# Altium schematic sheet Connectors+CSA.SchDoc
size A4; SheetNumber: 2; SheetTotal: 2
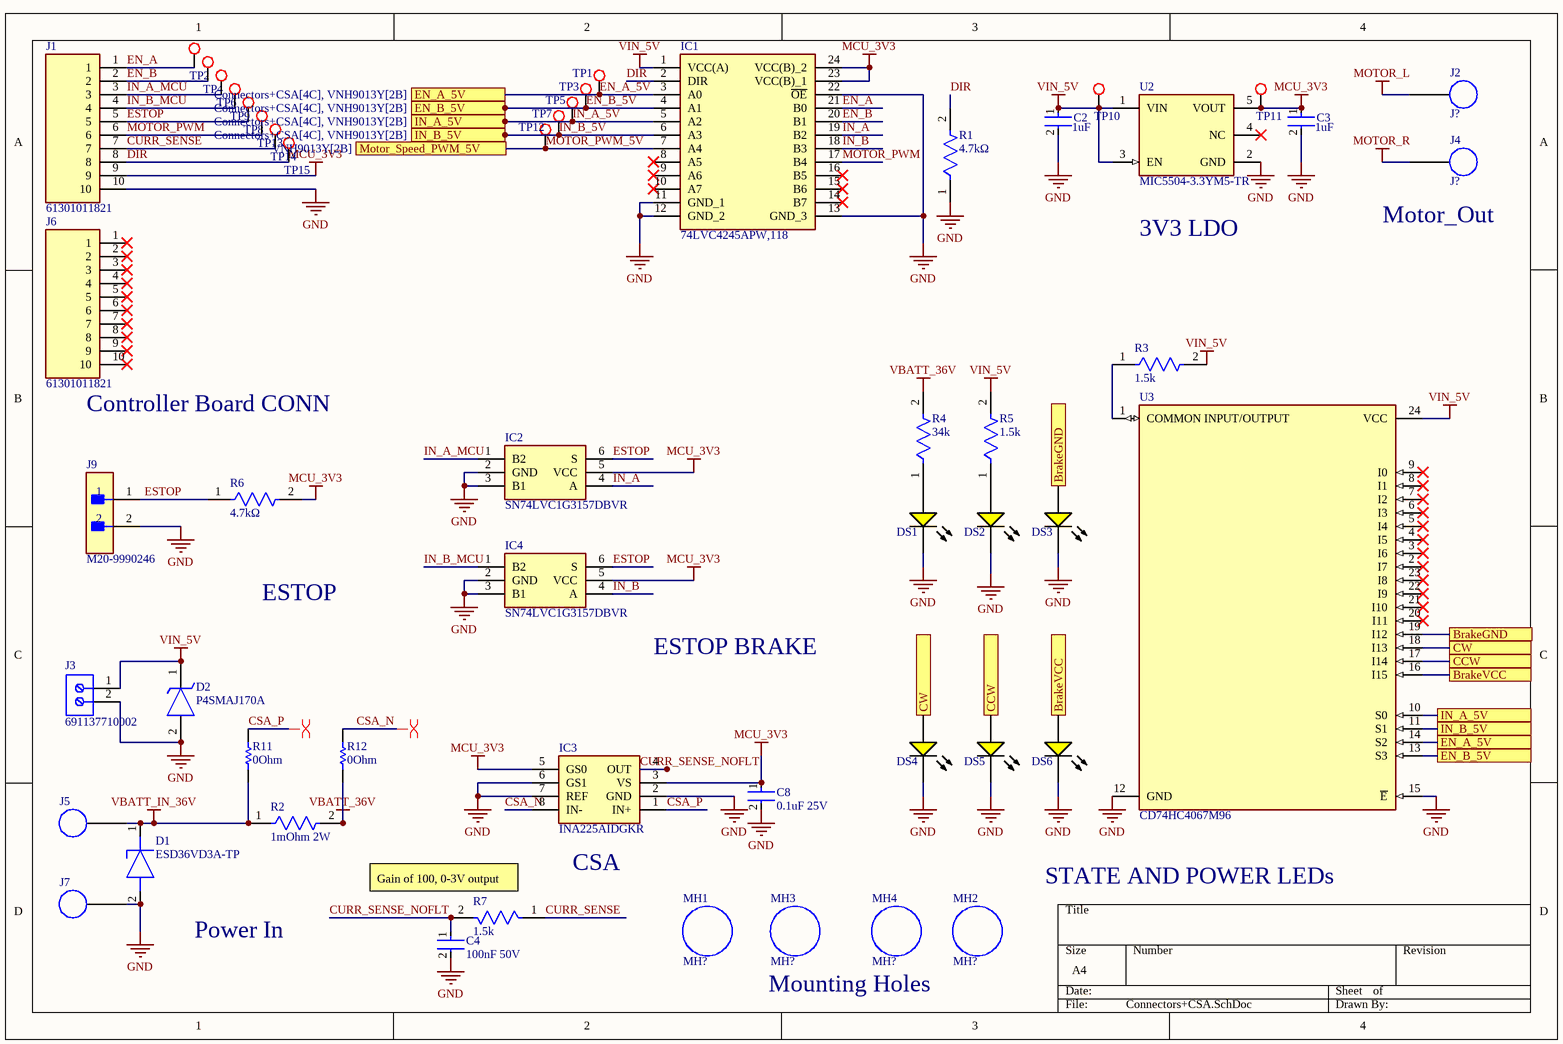
[diagram p0: Connectors+CSA.SchDoc]

## Parts
C2  1uF  [FP-CL10-IPC_C]
C3  1uF  [FP-CL10-IPC_C]
C4  100nF 50V  [FP-CL31-IPC_C]
C8  0.1uF 25V  [FP-CL21-IPC_C]
D1  ESD36VD3A-TP  [SOD2512X115N]
D2  P4SMAJ170A  [DIOM5027X240N]
DS1  HSMY-C190  [AVAG-HSMX-C190_V]  (value not drawn)
DS2  HSMY-C190  [AVAG-HSMX-C190_V]  (value not drawn)
DS3  HSMY-C190  [AVAG-HSMX-C190_V]  (value not drawn)
DS4  HSMY-C190  [AVAG-HSMX-C190_V]  (value not drawn)
DS5  HSMY-C190  [AVAG-HSMX-C190_V]  (value not drawn)
DS6  HSMY-C190  [AVAG-HSMX-C190_V]  (value not drawn)
IC1  74LVC4245APW,118  [SOP65P640X110-24N]
IC2  SN74LVC1G3157DBVR  [SOT95P280X145-6N]
IC3  INA225AIDGKR  [SOP65P490X110-8N]
IC4  SN74LVC1G3157DBVR  [SOT95P280X145-6N]
J1  61301011821  [RHDR10W60P0X254_1X10_2590X250X850P]
J2  J?  [Power Screw Terminal]  (no BOM)
J3  691137710002  [691137710002]
J4  J?  [Power Screw Terminal]  (no BOM)
J5  J?  [Power Screw Terminal]  (value not drawn)  (no BOM)
J6  61301011821  [RHDR10W60P0X254_1X10_2590X250X850P]
J7  J?  [Power Screw Terminal]  (value not drawn)  (no BOM)
J9  M20-9990246  [FP-M20-9990246-MFG]  (no BOM)
MH1  MH?  [Mounting Hole]  (no BOM)
MH2  MH?  [Mounting Hole]  (no BOM)
MH3  MH?  [Mounting Hole]  (no BOM)
MH4  MH?  [Mounting Hole]  (no BOM)
R1  4.7kΩ  [FP-RT0805-MFG]
R2  1mOhm 2W  [FP-WSL2512-MFG]
R3  1.5k  [FP-RC1608-IPC_B]
R4  34k  [FP-CRCW0805-e3-IPC_B]
R5  1.5k  [FP-RC1608-IPC_B]
R6  4.7kΩ  [FP-RT0805-MFG]
R7  1.5k  [FP-CRCW0603-e3-IPC_A]
R11  0Ohm  [RESC2013X60X35LL10T20]  (no BOM)
R12  0Ohm  [RESC2013X60X35LL10T20]  (no BOM)
TP1  TP  [Testpoint]  (value not drawn)  (no BOM)
TP2  TP  [Testpoint]  (value not drawn)
TP3  TP  [Testpoint]  (value not drawn)  (no BOM)
TP4  TP  [Testpoint]  (value not drawn)
TP5  TP  [Testpoint]  (value not drawn)  (no BOM)
TP6  TP  [Testpoint]  (value not drawn)
TP7  TP  [Testpoint]  (value not drawn)  (no BOM)
TP8  TP  [Testpoint]  (value not drawn)  (no BOM)
TP9  TP  [Testpoint]  (value not drawn)
TP10  TP  [Testpoint]  (value not drawn)  (no BOM)
TP11  TP  [Testpoint]  (value not drawn)  (no BOM)
TP12  TP  [Testpoint]  (value not drawn)  (no BOM)
TP13  TP  [Testpoint]  (value not drawn)  (no BOM)
TP14  TP  [Testpoint]  (value not drawn)  (no BOM)
TP15  TP  [Testpoint]  (value not drawn)  (no BOM)
U2  MIC5504-3.3YM5-TR  [FP-SOT23-5LD-PL-1-MFG]
U3  CD74HC4067M96  [FP-DW0024A-MFG]

## Ports
BrakeGND (see Connectors+CSA[3B]), BrakeGND (see Connectors+CSA[4C]), BrakeVCC (see Connectors+CSA[3C]), BrakeVCC (see Connectors+CSA[4C]), CCW (see Connectors+CSA[3C]), CCW (see Connectors+CSA[4C]), CW (see Connectors+CSA[3C]), CW (see Connectors+CSA[4C]), EN_A_5V (see Connectors+CSA[2A], VNH9013Y[2B]), EN_A_5V (see Connectors+CSA[4C], VNH9013Y[2B]), EN_B_5V (see Connectors+CSA[2A], VNH9013Y[2B]), EN_B_5V (see Connectors+CSA[4C], VNH9013Y[2B]), IN_A_5V (see Connectors+CSA[2A], VNH9013Y[2B]), IN_A_5V (see Connectors+CSA[4C], VNH9013Y[2B]), IN_B_5V (see Connectors+CSA[2A], VNH9013Y[2B]), IN_B_5V (see Connectors+CSA[4C], VNH9013Y[2B]), Motor_Speed_PWM_5V (see VNH9013Y[2B])

## Nets
GND: C2.2 C3.2 C4.2 C8.2 D1.2(A) D2.2(A) DS1.2(K) DS2.2(K) DS3.2(K) DS4.2(K) DS5.2(K) DS6.2(K) IC1.11(GND_1) IC1.12(GND_2) IC1.13(GND_3) IC1.22(~{OE}) IC2.2(GND) IC2.3(B1) IC3.2(GND) IC3.6(GS1) IC3.7(REF) IC4.2(GND) IC4.3(B1) J1.10 J3.2 J7.1 J9.2 R1.1 U2.2(GND) U3.12(GND) U3.15(~{E})
MCU_3V3: C3.1 C8.1 IC1.23(VCC(B)_1) IC1.24(VCC(B)_2) IC2.5(VCC) IC3.3(VS) IC3.5(GS0) IC4.5(VCC) J1.9 R6.2 TP11.0 U2.5(VOUT)
MOTOR_L: J2.1
MOTOR_R: J4.1
VBATT_36V: R2.2 R4.2 R12.2
VBATT_IN_36V: D1.1(K) J5.1 R2.1 R11.2
VIN_5V: C2.1 D2.1(K) IC1.1(VCC(A)) J3.1 R3.2 R5.2 TP10.0 U2.1(VIN) U2.3(EN) U3.24(VCC)
BrakeGND: DS3.1(A) U3.19(I12) ; port BrakeGND
BrakeVCC: DS6.1(A) U3.16(I15) ; port BrakeVCC
CCW: DS5.1(A) U3.17(I14) ; port CCW
CSA_N: IC3.8(IN-) R12.1
CSA_P: IC3.1(IN+) R11.1
CURR_SENSE: J1.7 R7.1 TP14.0
CURR_SENSE_NOFLT: C4.1 IC3.4(OUT) R7.2
CW: DS4.1(A) U3.18(I13) ; port CW
DIR: IC1.2(DIR) J1.8 R1.2 TP15.0
EN_A: IC1.21(B0) J1.1 TP2.0
EN_A_5V: IC1.3(A0) TP1.0 U3.14(S2) ; port EN_A_5V
EN_B: IC1.20(B1) J1.2 TP4.0
EN_B_5V: IC1.4(A1) TP3.0 U3.13(S3) ; port EN_B_5V
ESTOP: IC2.6(S) IC4.6(S) J1.5 J9.1 R6.1 TP8.0
IN_A: IC1.19(B2) IC2.4(A)
IN_A_5V: IC1.5(A2) TP5.0 U3.10(S0) ; port IN_A_5V
IN_A_MCU: IC2.1(B2) J1.3 TP6.0
IN_B: IC1.18(B3) IC4.4(A)
IN_B_5V: IC1.6(A3) TP7.0 U3.11(S1) ; port IN_B_5V
IN_B_MCU: IC4.1(B2) J1.4 TP9.0
MOTOR_PWM: IC1.17(B4) J1.6 TP13.0
MOTOR_PWM_5V: IC1.7(A4) TP12.0 ; port Motor_Speed_PWM_5V
NetDS1_1: DS1.1(A) R4.1
NetDS2_1: DS2.1(A) R5.1
NetR3_1: R3.1 U3.1(COMMON_INPUT/OUTPUT)

Not connected (* = marked no-connect by the designer): IC1 8(A5)* 9(A6)* 10(A7)* 14(B7)* 15(B6)* 16(B5)*; J6 1* 2* 3* 4* 5* 6* 7* 8* 9* 10*; U2 4(NC)*; U3 2(I7)* 3(I6)* 4(I5)* 5(I4)* 6(I3)* 7(I2)* 8(I1)* 9(I0)* 20(I11)* 21(I10)* 22(I9)* 23(I8)*

## Layout directives
differential pair: CSA_N, CSA_P

## Notes on the sheet
- 3V3 LDO
- (near J4) Motor_Out
- (near J6) Controller Board CONN
- ESTOP
- (near IC4) ESTOP BRAKE
- (near R7) Gain of 100, 0-3V output
- (near IC3) CSA
- STATE AND POWER LEDs
- Power In
- Mounting Holes

## Library data of the parts
C2 C3 = CMP-13271-003399-1: Cap Ceramic 1uF 10V X5R ±10% Pad SMD 0603 +85°C T/R; Min Operating Temperature: -55°C; Max Operating Temperature: 85°C; Dielectric: X5R; Contact Plating: Tin; Height: 0.8mm; Voltage: 10V; Packaging: Tape and Reel; Voltage Rating: 10V; Capacitance: 1uF; Package Quantity: 1; Width: 0.031inch; Length: 1.6mm; Depth: 0.8mm; Case/Package: 0603; Case Code (Imperial): 0603; Thickness: 0.035inch; Radiation Hardening: No; Tolerance: 10%; Case Code (Metric): 1608; Mount: Surface Mount
C4 = CMP-13271-001276-1: Cap Ceramic 100nF 50V X7R ±10% SMD 1206 +125°C Embossed T/R; Dielectric: X7R; Case Code (Metric): 3216; Package Quantity: 1; Thickness: 0.037inch; Depth: 1.6mm; Packaging: Tape and Reel; Capacitance: 100nF; Length: 0.126inch; Tolerance: 10%; Voltage Rating: 50V; Case Code (Imperial): 1206; Radiation Hardening: No; Width: 0.063inch; Case/Package: 1206; Max Operating Temperature: 125°C; Min Operating Temperature: -55°C; Height: 0.85mm; Mount: Surface Mount
C8 = CMP-13271-002094-1: CL21 Series 0805 100nF 25V -20/+80% Tolerance Y5V Multilayer Ceramic Chip Capacitor; Tolerance: 80%; Case/Package: 0805; Width: 0.049inch; Mount: Surface Mount; Packaging: Tape and Reel; Dielectric: Y5V; Voltage Rating (DC): 25V; Thickness: 0.03inch; Lead Free: Lead Free; Package Quantity: 1; Max Operating Temperature: 85°C; Case Code (Imperial): 0805; Min Operating Temperature: -30°C; Length: 2mm; Height: 0.65mm; Radiation Hardening: No; Depth: 1.25mm; Capacitance: 100nF; Case Code (Metric): 2012; Voltage Rating: 25V
D1 = ESD36VD3A-TP: Diode ESD (Uni-directional); Manufacturer_Name: MCC; Datasheet Link: https://www.mccsemi.com/pdf/Products/ESD3V3D3A_ESD36VD3A(SOD-323).pdf; Height: 1.15mm; Manufacturer_Part_Number: ESD36VD3A-TP
D2 = P4SMAJ170A: TVS Diode (Uni-directional); Manufacturer_Name: Diotec; Datasheet Link: https://diotec.com/request/datasheet/p4smaj65.pdf; Height: 2.4mm; Manufacturer_Part_Number: P4SMAJ170A
DS1-DS6 = CMP-1744-00003-1: LED Uni-Color Yellow, 65 mW, 20 mA, -40 to 85 degC, 2-Pin SMD, RoHS, Tape and Reel; Tolerance: 1%; Voltage Rating: 50 V; Power Rating: 100 mW; Case\Package: 0603; Resistance: 390 Ohm; Min Operating Temperature: -55 degC; Length: 1.6 mm; ComponentLink3Description: Package Specification; Mount: Surface Mount; PackageReference: HSMX-C190; ComponentLink2Description: Datasheet; DatasheetVersion: Mar-12; Case Code (Metric): 1608; Pins: 2; Package Quantity: 5000; ComponentLink2URL: http://docs.avagotech.com/docs/AV02-0551EN; ComponentLink1Description: Manufacturer URL; RoHSCompliant: true; Packaging: Tape and Reel; PackageDescription: 2-Pin Surface Mount Device, Body 1.6 x 0.8 mm, Height 0.9 mm; REACH SVHC: No SVHC; ComponentLink3URL: http://www.fairchildsemi.com/dwg/MA/MA03D.pdf; Voltage Rating (DC): 50 V; Width: 0.8 mm; ComponentLink1URL: http://www.avagotech.com/; Max Operating Temperature: 155 degC; Case Code (Imperial): 0603; Height: 0.45 mm
IC1 = 74LVC4245APW,118: Integrated Circuit; Manufacturer_Name: Nexperia; Datasheet Link: https://assets.nexperia.com/documents/data-sheet/74LVC4245A.pdf; Height: 1.1mm; Manufacturer_Part_Number: 74LVC4245APW,118; Mouser Part Number: 771-74LVC4245APW-T; Mouser Price/Stock: https://www.mouser.co.uk/ProductDetail/Nexperia/74LVC4245APW118?qs=me8TqzrmIYXtBCPNCA6vcg%3D%3D; Arrow Part Number: 74LVC4245APW,118; Arrow Price/Stock: https://www.arrow.com/en/products/74lvc4245apw118/nexperia?region=nac
IC2 IC4 = SN74LVC1G3157DBVR: Integrated Circuit; Manufacturer_Name: Texas Instruments; Datasheet Link: http://componentsearchengine.com/Datasheets/1/SN74LVC1G3157DBVR.pdf; Height: 1.45mm; Manufacturer_Part_Number: SN74LVC1G3157DBVR; Mouser Part Number: 595-SN74LVC1G3157DBV; Mouser Price/Stock: https://www.mouser.co.uk/ProductDetail/Texas-Instruments/SN74LVC1G3157DBVR?qs=PVVDbbWpW3ID6l2sElWeMw%3D%3D; Arrow Part Number: SN74LVC1G3157DBVR; Arrow Price/Stock: https://www.arrow.com/en/products/sn74lvc1g3157dbvr/texas-instruments?utm_currency=USD&region=nac
IC3 = INA225AIDGKR: Integrated Circuit; Manufacturer_Name: Texas Instruments; Datasheet Link: http://www.ti.com/lit/ds/symlink/ina225.pdf; Height: 1.1mm; Manufacturer_Part_Number: INA225AIDGKR; Arrow Part Number: INA225AIDGKR; Arrow Price/Stock: https://www.arrow.com/en/products/ina225aidgkr/texas-instruments?region=nac
J1 J6 = 61301011821: Connector; Manufacturer_Name: Wurth Elektronik; Datasheet Link: http://katalog.we-online.de/em/datasheet/6130xx11821.pdf; Height: 8.5mm; Manufacturer_Part_Number: 61301011821; Mouser Part Number: 710-61301011821; Mouser Price/Stock: https://www.mouser.co.uk/ProductDetail/Wurth-Elektronik/61301011821?qs=W%252B2sBeLta1ZhlLR0YCzonQ%3D%3D
J2 J4 J5 J7 = Screw Connector
J3 = CMP-1502-03324-2: NexarPartId: 78871135; Voltage Rating: 300V; Number of Contacts: 2; Current Rating: 16A; Lead Pitch: 5mm; Height: 11.6mm; Packaging: Box; RoHS: Non-Compliant; Contact Material: Nickel, Tin; Max Operating Temperature: 120°C; Number of Pins: 2; Min Operating Temperature: -30°C; Number of Rows: 1
J9 = CMP-15831-000009-1: CONN HEADER VERT 2POS 2.54MM; Manufacturer: Harwin; Conn Gender: Male; Conn Orientation: Vertical; Number Of Contacts: 2; Current Rating: 3A; ComponentLink2URL: https://cdn.harwin.com/pdfs/M20-999.pdf; ComponentLink2Description: Datasheet; Package: M20-9990246; Temperature: -40°C to +105°C; Octopart: https://octopart.com/m20-9990246-harwin-2590635; Mouser Description: 2.54mm (0.1") Pitch SIL Vertical PC Tail Pin Header, 6.1mm mating pin height, tin, 2 contacts; Temperature Range High: +105°C; Device Class L1: Connectors; RoHS: TRUE; Automotive: No; Height: 8.99mm; Number Of Rows: 1; Contact Material: Tin,Nickel; Category: Conn; Pitch: 2.54mm; Lead Free: Yes; Digikey Description: CONN HEADER VERT 2POS 2.54MM; Manufacturer Part Number: M20-9990246; Temperature Range Low: -40°C; Device Class L3: unset; Device Class L2: Headers and Wire Housings
MH1-MH4 = Mounting Hole
R1 R6 = CMP-03412-019393-1: RES SMD 4.7K OHM 1% 1/8W 0805; Manufacturer Part Number: RT0805FRE074K7L; Manufacturer: Yageo; Tolerance: 0.0001; Power Rating: 0.125W; Voltage Rating: 150V; Temperature Coefficient: 50 ppm/°C; Device Class L1: Passive Components; Category: Res; Temperature Range Low: -55°C; Device Class L2: Resistors; Ipc Land Pattern Name: RESC200125X50; Package: RT0805; Device Class L3: Chip SMD Resistors; Temperature: -55°C to +155°C; ComponentLink2Description: Datasheet; Footprint Url: http://www.yageo.com/exep/pages/download/literatures/PYu-R_Mount_10.pdf; Series: RT; Mouser Description: Thin Film Resistors - SMD 1/8W 4.7K ohm 1% 50ppm; Height: 0.6mm; Resistance: 4.7KΩ; Octopart: https://octopart.com/rt0805fre074k7l-yageo-40047233; Value: 4.7KΩ; Digikey Description: RES SMD 4.7K OHM 1% 1/8W 0805; Composition: Thin Film; Automotive: No; Temperature Range High: +155°C; Lead Free: Yes; ComponentLink2URL: http://www.yageo.com/documents/recent/PYu-RT_1-to-0.01_RoHS_L_9.pdf; RoHS: TRUE
R2 = CMP-00030-41947086-1: WSL25121L000FEA18 Res Metal Strip 2512 0.001 Ohm 1% 2W ±275ppm/C Sulfur Resistant Pad SMD Automotive T/R; Resistance: 1mΩ; Temperature Coefficient: 275ppm/°C; Termination: SMD/SMT; Weight: 63.58798mg; Min Operating Temperature: -65°C; RoHS: Compliant; Case/Package: 2512; Max Power Dissipation: 2W; Case Code (Imperial): 2512; Lead Free: Lead Free; Radiation Hardening: No; Height: 889µm; Number of Pins: 2512; Tolerance: 1%; Case Code (Metric): 6432; Schedule B: 8533210045, 8533210045; Length: 6.35mm; Packaging: Tape and Reel; Number of Terminations: 2; Max Operating Temperature: 170°C; Width: 3.2mm; NexarPartId: 41947086; Features: Moisture Resistant; Composition: Metal Element; Contact Plating: Tin; Power Rating: 2W
R3 R5 = CMP-13261-004935-1: Res Thick Film 0603 1.5kΩ 1% 0.1W ±100ppm/°C Molded SMD T/R; Resistance: 1.5kR; Voltage Rating (DC): 50V; Power Rating: 100mW; Contact Plating: Tin; Depth: 0.8mm; Width: 800um; Tolerance: 1%; Lead Free: Lead Free; Composition: Thick Film; Military Standard: Not; Temperature Coefficient: 100ppm/°C; Radiation Hardening: No; Length: 1.6mm; Case/Package: 0603; Max Operating Temperature: 155°C; Packaging: Tape and Reel; Min Operating Temperature: -55°C
R4 = CMP-2001-03837-2: RES Thick Film, 34kΩ, 1%, 0.125W, 100ppm/°C, 0805; Resistance: 34kR; Max Power Dissipation: 125mW; Voltage Rating (DC): 150V; Radiation Hardening: No; Case Code (Metric): 2012; Weight: 0.000194oz; Composition: Thick Film; Lead Free: Lead Free; Military Standard: Not; Contact Plating: Tin; Height: 0.02inch; Packaging: Tape and Reel; Depth: 1.25mm; Max Operating Temperature: 155°C; Temperature Coefficient: 100ppm/°C; Width: 0.049inch; Case/Package: 0805; Number of Terminations: 2; Working Voltage: 150V; Power Rating: 125mW; Package Quantity: 10; Min Operating Temperature: -55°C; Termination: SMD/SMT; Features: Automotive AEC-Q200; Tolerance: 1%; Case Code (Imperial): 0805; Voltage Rating: 150V; Length: 2mm
R7 = CMP-2000-02995-2: RES Thick Film, 1.5kΩ, 1%, 0.1W, 100ppm/°C, 0603; Working Voltage: 75V; Power Rating: 100mW; Resistance: 1.5kR; Max Operating Temperature: 155°C; Features: Automotive AEC-Q200; Min Operating Temperature: -55°C; Width: 0.033inch; Case/Package: 0603; Voltage Rating (DC): 75V; Termination: SMD/SMT; Mount: Surface Mount; Weight: 7.1E-05oz; Case Code (Metric): 1608; Height: 0.45mm; Voltage Rating: 75V; Length: 1.55mm; Package Quantity: 10; Lead Free: Lead Free; Composition: Thick Film; Packaging: Tape and Reel; Temperature Coefficient: 100ppm/°C; Tolerance: 1%; Military Standard: Not; Case Code (Imperial): 0603; Number of Terminations: 2; Max Power Dissipation: 100mW; Depth: 0.85mm; Contact Plating: Tin
R11 R12 = CMP-2000-06963-1: Chip Resistor, 0 Ohm, +/- 5%, 125 mW, -55 to 155 degC, 0805 (2012 Metric), RoHS, Tape and Reel; Manufacturer: Yageo; Product Length (mm): 2mm; Tolerance (+ or -): NotRequired; Case Style: Molded; Product Height (mm): 0.5mm; Power Rating(s): NotRequiredW; Product Depth (mm): 1.25mm; Mounting Technology: SurfaceMount; Military Standard: NotRequired; Operating Temp Range: -55Cto155C; Temperature Coefficient: NotRequired; Package Description: 2-Pin Surface Mounted Device, Body 2 x 1.25 mm; Datasheet Version: Rev. 7, 05/2017; Failure Rate: NotRequired; Manufacturer URL: http://www.yageo.com/; Datasheet URL: http://www.yageo.com/documents/recent/PYu-RC_Group_51_RoHS_L_7.pdf; Packaging: TapeandReel; Package Reference: 0805; Package / Case: 0805; Termination Style: NotRequired; Type: ThickFilm; Construction: Rectangular
TP1-TP15 = Testpoint
U2 = CMP-2000-07604-2: IC REG LINEAR 3.3V 300MA SOT23-5; Quiescent Current: 38uA; Operating Supply Current: 42uA; Max Input Voltage: 5.5V; Min Input Voltage: 2.5V; Output Type: Fixed; Power Supply Rejection Ratio (PSRR): 60dB; Dropout Voltage: 380mV; Accuracy: 3%; Number of Outputs: 1; Nominal Output Voltage: 3.3V; Max Output Current: 300mA; Length: 2.9mm; Mount: Surface Mount; Width: 1.6mm; Packaging: Tape and Reel; Output Current: 300mA; Min Operating Temperature: -40°C; Max Operating Temperature: 125°C; Height: 1.1mm; Case/Package: SOT-23-5; REACH SVHC: No SVHC; Number of Pins: 5; Output Voltage: 3.3V
U3 = CMP-04901-000007-1: IC MUX/DEMUX 1X16 24SOIC; Manufacturer: Texas Instruments; Standoff Height: 0.1mm; Logic Function Desc: Non-Inverting; Max Supply Voltage: 6V; Number Of Inputs: 16; Quiescent Current: 8uA; Number Of Circuits: 1; Propagation Delay: 6ns; Max Junction Temp: +150°C; Min Supply Voltage: 2V; ComponentLink2Description: Datasheet; Octopart: https://octopart.com/cd74hc4067m96-texas+instruments-722802; Ambient Temperature Range High: +125°C; Ipc Land Pattern Name: SOIC127P1030X265-24; Height: 2.65mm; Mouser Description: Multiplexer Switch ICs Hi-Spd CMOS 16Ch Anl Mltplxr/Demltplxr; Temperature Range Low: -55°C; Package: DW0024A; Temperature Range High: +125°C; Lead Free: Yes; ComponentLink2URL: http://www.ti.com/lit/ds/symlink/cd74hc4067.pdf; Manufacturer Part Number: CD74HC4067M96; RoHS: TRUE; Automotive: No; Device Class L1: Integrated Circuits (ICs); Digikey Description: IC MUX/DEMUX 1X16 24SOIC; Device Class L2: Logic ICs; Temperature: -55°C to +125°C; Device Class L3: Multiplexers; Category: IC; Ambient Temperature Range Low: -55°C; Number Of Outputs: 1